# EAGLE schematic BSPD Test Board manufactured 2016-12-12 (EAGLE 7.6.0)
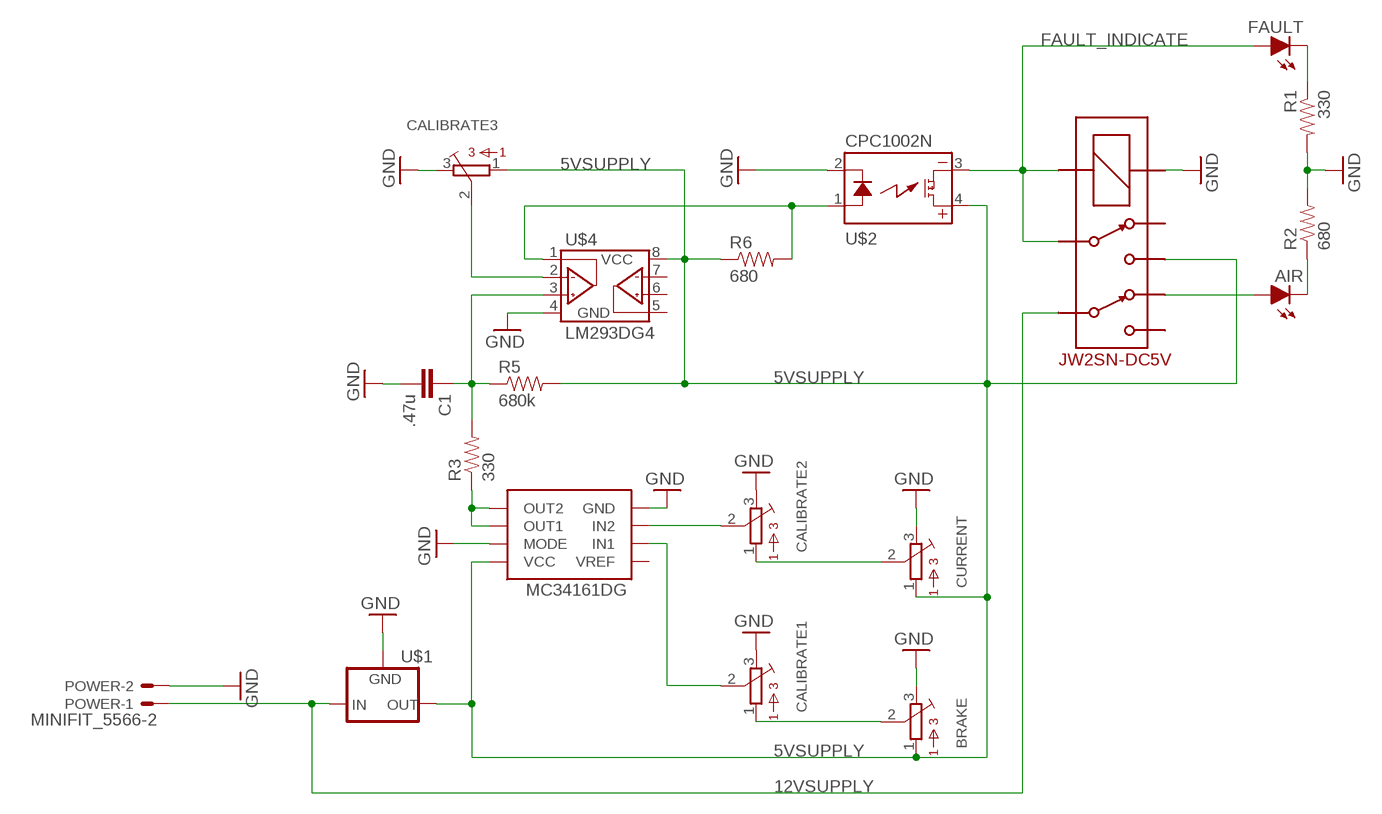
[diagram p0: schematic, sheet 1]

## Parts
AIR  LED-5MM  [LED-5MM]
BRAKE  TRIMPOT_3296C  [TRIMPOT_3296]
C1  .47u  CAPEZ  [CAP-PTH-SMALLEZ]
CALIBRATE1  TRIMPOT_3296C  [TRIMPOT_3296]
CALIBRATE2  TRIMPOT_3296C  [TRIMPOT_3296]
CALIBRATE3  TRIMPOT_3296C  [TRIMPOT_3296]
CURRENT  TRIMPOT_3296C  [TRIMPOT_3296]
FAULT  LED-5MM  [LED-5MM]
MC34161DG  MC34161DG  [SOIC-08]
POWER  MINIFIT_5566-2  [MINIFIT_5566-2]
R1  330  RESISTOR0805-RES  [0805]
R2  680  RESISTOR0805-RES  [0805]
R3  330  RESISTOR0805-RES  [0805]
R5  680k  RESISTOREZ  [AXIAL-0.3EZ]
R6  680  RESISTOR0805-RES  [0805]
U$1  5V_REGULATOR_LM340-NLM340MPX-5.0/NOPB  [SOT223]
U$2  CPC1002N  [SOP04]
U$3  DPDT_RELAY_PANASONIC_JW2SN-DC5V  [DPDT_RELAY_PANASONIC_JW2SN]
U$4  LM293DG4  [SOIC-08]

## Nets
5VSUPPLY: BRAKE.1 CALIBRATE3.1 CURRENT.1 MC34161DG.8(VCC) R5.P$2 R6.1 U$1.3(OUT) U$2.4(DC+) U$3.4 U$4.8(VCC)
12VSUPPLY: POWER.1 U$1.1(IN) U$3.6
FAULT_INDICATE: FAULT.A U$2.3(DC-) U$3.3 U$3.COIL-
GND: BRAKE.3 C1.2 CALIBRATE1.3 CALIBRATE2.3 CALIBRATE3.3 CURRENT.3 MC34161DG.4(GND) MC34161DG.7(MODE) POWER.2 R1.2 R2.2 U$1.2(GND) U$1.4(GND) U$2.2(CONTROL-) U$3.COIL+ U$4.4(GND)
N$1: FAULT.K(C) R1.1
N$3: BRAKE.2 CALIBRATE1.1
N$4: CALIBRATE2.1 CURRENT.2
N$5: CALIBRATE2.2 MC34161DG.3(IN2)
N$6: CALIBRATE1.2 MC34161DG.2(IN1)
N$7: CALIBRATE3.2 U$4.2(1IN-)
N$9: R6.2 U$2.1(CONTROL+) U$4.1(1OUT)
N$11: AIR.A U$3.7
N$12: AIR.K(C) R2.1
N$13: C1.1 R3.2 R5.P$1 U$4.3(1IN+)
N$14: MC34161DG.5(OUT2) MC34161DG.6(OUT1) R3.1
Unconnected: MC34161DG.1(VREF) U$3.2 U$3.5 U$4.5(2IN+) U$4.6(2IN-) U$4.7(2OUT)

## Library data of the parts
AIR FAULT = HyTechDevices:LED: Light Emitting Diode (LED) Source: Dangerous Prototypes Eagle Library <https://github.com/DangerousPrototypes/Eagle_Part_Library>
BRAKE CALIBRATE1-CALIBRATE3 CURRENT = HyTechDevices:TRIMPOT_3296: 3296 Series 3/8" Square Trimmer Source <https://github.com/chiengineer/Eagle-Libraries/blob/master/Potentiometers/bourns.lbr>
C1 = HyTechDevices:CAP: Capacitor Standard 0603 ceramic capacitor, and 0.1" leaded capacitor.
MC34161DG = HyTechDevices:MC34161DG: ON Semiconductor MC34161 Dual Channel Voltage Monitor
POWER = HyTechDevices:MINIFIT_5566-2: Mini-Fit Junior connector 2 pole Source: http://www.molex.com; OC_FARNELL: 1822072; OC_NEWARK: unknown
R1-R3 R5 R6 = HyTechDevices:RESISTOR: Resistor Basic schematic elements and footprints for 0603, 1206, and PTH resistors.
U$1 = HyTechDevices:5V_REGULATOR_LM340-N: Voltage Regulator 5v linear voltage regulator Datasheet <http://www.mouser.com/ProductDetail/Texas-Instruments/LM340MPX-50-NOPB/?qs=X1J7HmVL2ZGZwtTFRQ9ItA%3D%3D> MAX current out: 1.5A MAX voltage in: 35V
U$2 = HyTechDevices:CPC1002N: IXYS Solid State Relay .7A
U$3 = HyTechDevices:DPDT_RELAY_PANASONIC_JW2SN-DC5V: Double Pull Double Throw Relay 5VDC Datasheet <http://www.mouser.com/ds/2/316/jw-catalog-461998.pdf> Product Page <http://www.mouser.com/ProductDetail/Panasonic-Industrial-Devices/JW2SN-DC5V>
U$4 = HyTechDevices:LM293: Texas Instruments LM293 Dual Differential Comparator